# Altium schematic sheet Wireless_Master.SchDoc
size A; SheetNumber: 5; SheetTotal: 5
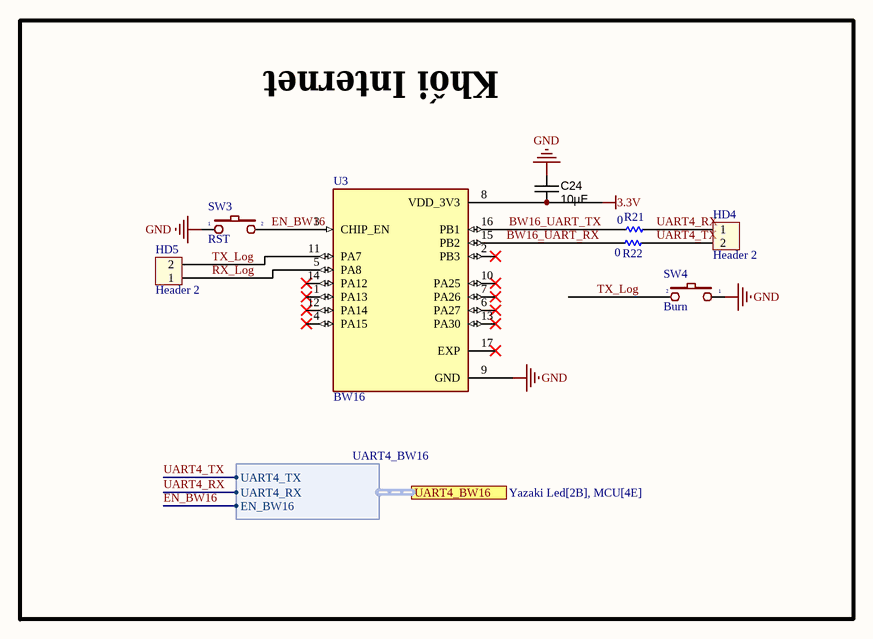
[diagram p0: Wireless_Master.SchDoc]

## Parts
C24  10µF  [CAPC1608X90N]
HD4  Header 2  [Header_2]
HD5  Header 2  [Header_2]
R21  0  [RES-SMD-0603]
R22  0  [RES-SMD-0603]
SW3  RST  [SW1-SMD]
SW4  Burn  [SW1-SMD]
U3  BW16  [MODULE_BW16]

## Ports
UART4_BW16 (harness UART4_BW16, see Yazaki Led[2B], MCU[4E])

## Harnesses
UART4_BW16: UART4_TX, UART4_RX, EN_BW16

## Nets
3.3V: C24.1 U3.8(VDD_3V3)
GND: C24.2 SW3.1 SW4.1 U3.9(GND)
BW16_UART_RX: R22.2 U3.15(PB2)
BW16_UART_TX: R21.2 U3.16(PB1)
EN_BW16: SW3.2 U3.3(CHIP_EN) ; port UART4_BW16.EN_BW16
RX_Log: HD5.1 U3.5(PA8)
TX_Log: HD5.2 SW4.2 U3.11(PA7)
UART4_RX: HD4.1 R21.1 ; port UART4_BW16.UART4_RX
UART4_TX: HD4.2 R22.1 ; port UART4_BW16.UART4_TX

Not connected (* = marked no-connect by the designer): U3 1(PA13)* 2(PB3)* 4(PA15)* 6(PA27)* 7(PA26)* 10(PA25)* 12(PA14)* 13(PA30)* 14(PA12)* 17(EXP)*

## Notes on the sheet
- Khối Internet

## Library data of the parts
C24 = CAPC_1uF_0603_X7R_35V_10%: 1µF ±10% 16V Ceramic Capacitor X7R 0603 (1608 Metric); Manufacturer 1: Taiyo Yuden; Manufacturer Part Number 1: GMK107AB7105KAHT; Voltage - Rated: 35V; Pcs 2: 10; Tolerance: ±10%; Operating Temperature: -55°C ~ 125°C; Package / Case: 0603 (1608 Metric); Temperature Coefficient: X7R; Ratings: AEC-Q200; Applications: Automotive; Packaging: Digi-Reel®; Supplier 1: Digi-Key; Supplier Part Number 1: 587-3352-6-ND; Supplier 2: http://www.tme.vn; Supplier Part Number 2: http://www.tme.vn/Product.aspx?id=728#page=pro_info; Price 2: 1800; Value: 10µF
HD4 HD5 = Header2: Value: Header 2
R21 R22 = Res-SMD: Resistor; Manufacturer: Generic Components; Class: Passive; Published: 08/06/2000; Publisher: Altium Hobart Technology Centre
SW3 SW4 = SW2: Switch button 2 pin; Value: SW chip 2 pin
U3 = BW16: dual-frequency Wi-Fi Bluetooth SoC module; MF: AI-Thinker; Availability: Not in stock; Check_prices: https://www.snapeda.com/parts/BW16/AI-Thinker/view-part/?ref=eda; Value: *; Package: Package; MP: BW16; Price: None; SnapEDA_Link: https://www.snapeda.com/parts/BW16/AI-Thinker/view-part/?ref=snap